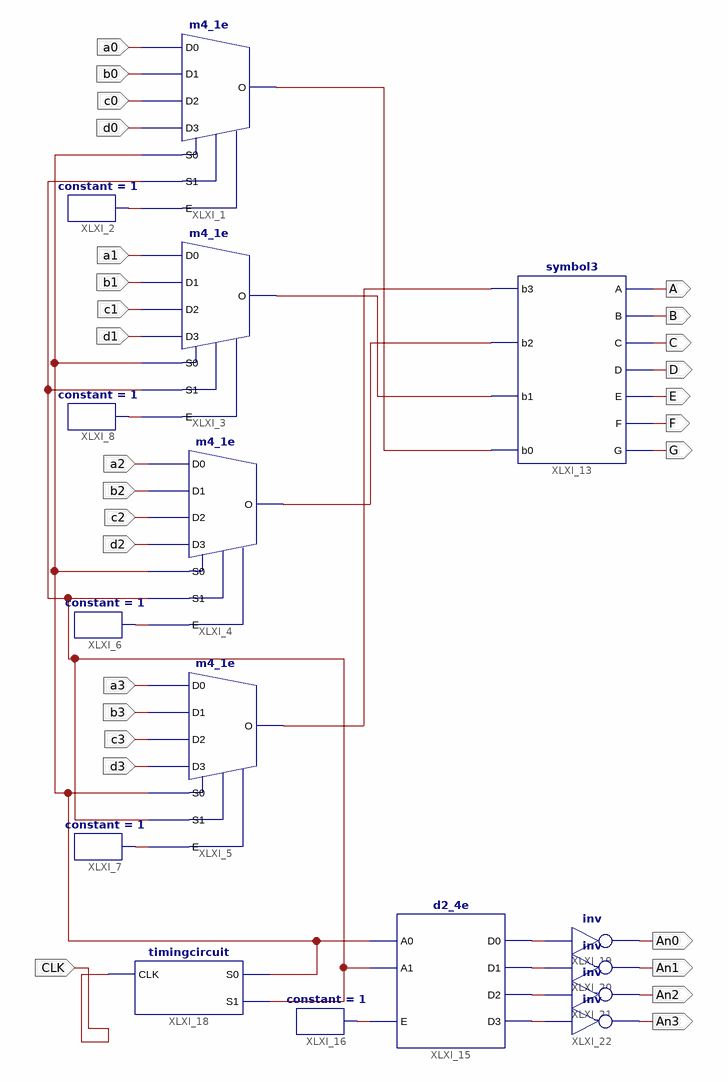
[diagram p0: schematic sheet 1]
// Xilinx ISE schematic assign4.sch (spartan6) as structural Verilog: 16 symbols, 28 ports
module assign4 (
  input  a0,
  input  b0,
  input  c0,
  input  d0,
  input  a1,
  input  b1,
  input  c1,
  input  d1,
  input  a2,
  input  b2,
  input  c2,
  input  d2,
  input  a3,
  input  b3,
  input  c3,
  input  d3,
  input  CLK,
  output A,
  output B,
  output C,
  output D,
  output E,
  output F,
  output G,
  output An1,
  output An0,
  output An2,
  output An3
);

  wire Anode1, Anode2, Anode3, XLXN_1, XLXN_2, XLXN_3, XLXN_4, XLXN_29, XLXN_30, XLXN_31, XLXN_32, XLXN_33,
       XLXN_48, XLXN_52, XLXN_53;

  m4_1e XLXI_1 (.D0(a0), .D1(b0), .D2(c0), .D3(d0), .E(XLXN_1), .S0(XLXN_52), .S1(XLXN_48), .O(XLXN_29));
  constant #(.CValue("1")) XLXI_2 (.O(XLXN_1));
  m4_1e XLXI_3 (.D0(a1), .D1(b1), .D2(c1), .D3(d1), .E(XLXN_4), .S0(XLXN_52), .S1(XLXN_48), .O(XLXN_30));
  m4_1e XLXI_4 (.D0(a2), .D1(b2), .D2(c2), .D3(d2), .E(XLXN_2), .S0(XLXN_52), .S1(XLXN_48), .O(XLXN_31));
  m4_1e XLXI_5 (.D0(a3), .D1(b3), .D2(c3), .D3(d3), .E(XLXN_3), .S0(XLXN_52), .S1(XLXN_48), .O(XLXN_32));
  constant #(.CValue("1")) XLXI_6 (.O(XLXN_2));
  constant #(.CValue("1")) XLXI_7 (.O(XLXN_3));
  constant #(.CValue("1")) XLXI_8 (.O(XLXN_4));
  symbol3 XLXI_13 (
    .b3(XLXN_32), .b2(XLXN_31), .b1(XLXN_30), .b0(XLXN_29), .A(A), .B(B), .C(C), .D(D), .E(E), .F(F), .G(G));
  d2_4e XLXI_15 (.A0(XLXN_52), .A1(XLXN_48), .E(XLXN_33), .D0(XLXN_53), .D1(Anode1), .D2(Anode2), .D3(Anode3));
  constant #(.CValue("1")) XLXI_16 (.O(XLXN_33));
  timingcircuit XLXI_18 (.CLK(CLK), .S0(XLXN_52), .S1(XLXN_48));
  not XLXI_19 (An0, XLXN_53);
  not XLXI_20 (An1, Anode1);
  not XLXI_21 (An2, Anode2);
  not XLXI_22 (An3, Anode3);
endmodule
